# EAGLE design LTP-ISP ADAPTER (EAGLE 4.15)
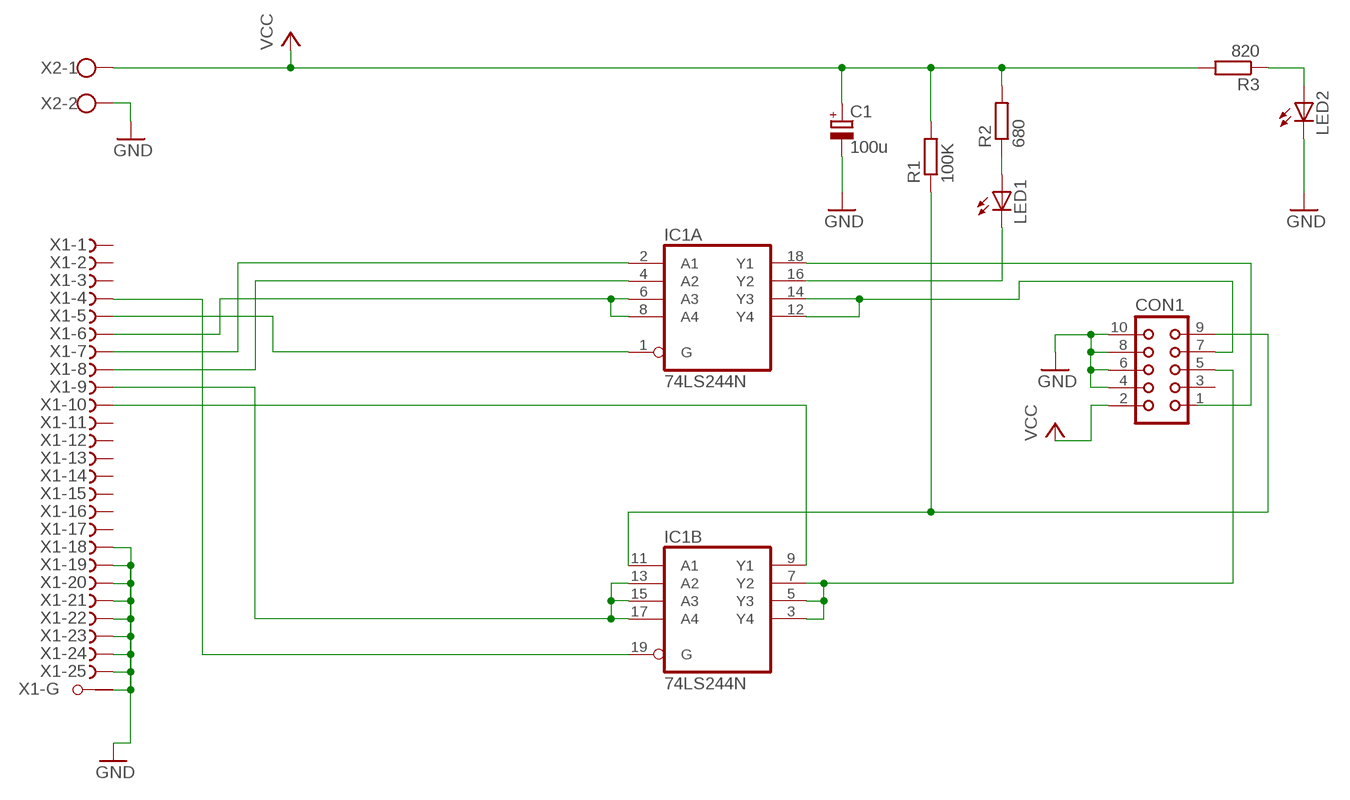
[diagram p0: schematic, sheet 1]

## Parts
C1  100u  CPOL-EUE2.5-7  [E2,5-7]
CON1  CON10  [CON10]
IC1  74LS244N  [DIL20]
LED1  LED3MM  [LED3MM]
LED2  LED3MM  [LED3MM]
R1  100K  R-EU_0207/7  [0207/7]
R2  680  R-EU_0207/7  [0207/7]
R3  820  R-EU_0207/7  [0207/7]
X1  F25HPS  [F25HP]
X2  W237-102  [W237-102]

## Nets
GND: C1.- CON1.4 CON1.6 CON1.8 CON1.10 LED2.K(C) X1.18(-18:F) X1.19(-19:F) X1.20(-20:F) X1.21(-21:F) X1.22(-22:F) X1.23(-23:F) X1.24(-24:F) X1.25(-25:F) X1.G1(-G:G1) X2.2
N$1: IC1.4(A:A2) X1.8(-8:F)
N$2: IC1.2(A:A1) X1.7(-7:F)
N$3: IC1.6(A:A3) IC1.8(A:A4) X1.6(-6:F)
N$4: IC1.1(A:G) X1.5(-5:F)
N$5: IC1.13(B:A2) IC1.15(B:A3) IC1.17(B:A4) X1.9(-9:F)
N$6: IC1.9(B:Y1) X1.10(-10:F)
N$7: IC1.19(B:G) X1.4(-4:F)
N$8: IC1.18(A:Y1)
N$9: CON1.7 IC1.12(A:Y4)
N$11: CON1.9 IC1.11(B:A1) R1.1
N$12: CON1.5 IC1.3(B:Y4) IC1.5(B:Y3) IC1.7(B:Y2)
N$14: IC1.16(A:Y2) LED1.K(C)
N$15: LED1.A R2.1
N$16: LED2.A R3.1
VCC: C1.+ CON1.2 R1.2 R2.2 R3.2 X2.1
Unconnected: CON1.1 CON1.3 IC1.14(A:Y3) X1.1(-1:F) X1.2(-2:F) X1.3(-3:F) X1.11(-11:F) X1.12(-12:F) X1.13(-13:F) X1.14(-14:F) X1.15(-15:F) X1.16(-16:F) X1.17(-17:F) X1.G2(-G:G2)

## Power pins joined to a net without a drawn wire
GND: IC1.10(P:GND)
VCC: IC1.20(P:VCC)

## Library data of the parts
C1 = rcl:CPOL-EU: POLARIZED CAPACITOR, European symbol
CON1 = con-harting:CON10: CONNECTOR
IC1 = 74xx-eu:74*244: Octal BUFFER and LINE DRIVER, 3-state
LED1 LED2 = led:LED: LED OSRAM: - CHIPLED LG R971, LG N971, LY N971, LG Q971, LY Q971, LO R971, LY R971 LH N974, LH R974 LS Q976, LO Q976, LY Q976 LO Q996 - Hyper CHIPLED LW Q18S LB Q993, LB Q99A, LB R99A - SideLED LS A670, LO A670, LY A670, LG A670, LP A670 LB A673, LV A673, LT A673, LW A673 LH A674 LY A675 LS A676, LA A676, LO A676, LY A676, LW A676 LS A679, LY A679, LG A679 - Hyper Micro SIDELED® LS Y876, LA Y876, LO Y876, LY Y876 LT Y87S - SmartLED LW L88C, LW L88S LB L89C, LB L89S, LG L890 LS L89K, LO L89K, LY L89K LS L896, LA L896, LO L896, LY L896 - TOPLED LS T670, LO T670, LY T670, LG T670, LP T670 LSG T670, LSP T670, LSY T670, LOP T670, LYG T670 LG T671, LOG T671, LSG T671 LB T673, LV T673, LT T673, LW T673 LH T674 LS T676, LA T676, LO T676, LY T676, LB T676, LH T676, LSB T676, LW T676 LB T67C, LV T67C, LT T67C, LS T67K, LO T67K, LY T67K, LW E67C LS E67B, LA E67B, LO E67B, LY E67B, LB E67C, LV E67C, LT E67C LW T67C LS T679, LY T679, LG T679 LS T770, LO T770, LY T770, LG T770, LP T770 LB T773, LV T773, LT T773, LW T773 LH T774 LS E675, LA E675, LY E675, LS T675 LS T776, LA T776, LO T776, LY T776, LB T776 LHGB T686 LT T68C, LB T68C - Hyper Mini TOPLED® LB M676 - Mini TOPLED Santana® LG M470 LS M47K, LO M47K, LY M47K Source: http://www.osram.convergy.de/
R1-R3 = rcl:R-EU_: RESISTOR, European symbol
X1 = con-subd:F25HPS: SUB-D
X2 = con-wago-500:W237-102: WAGO SCREW CLAMP

## Board
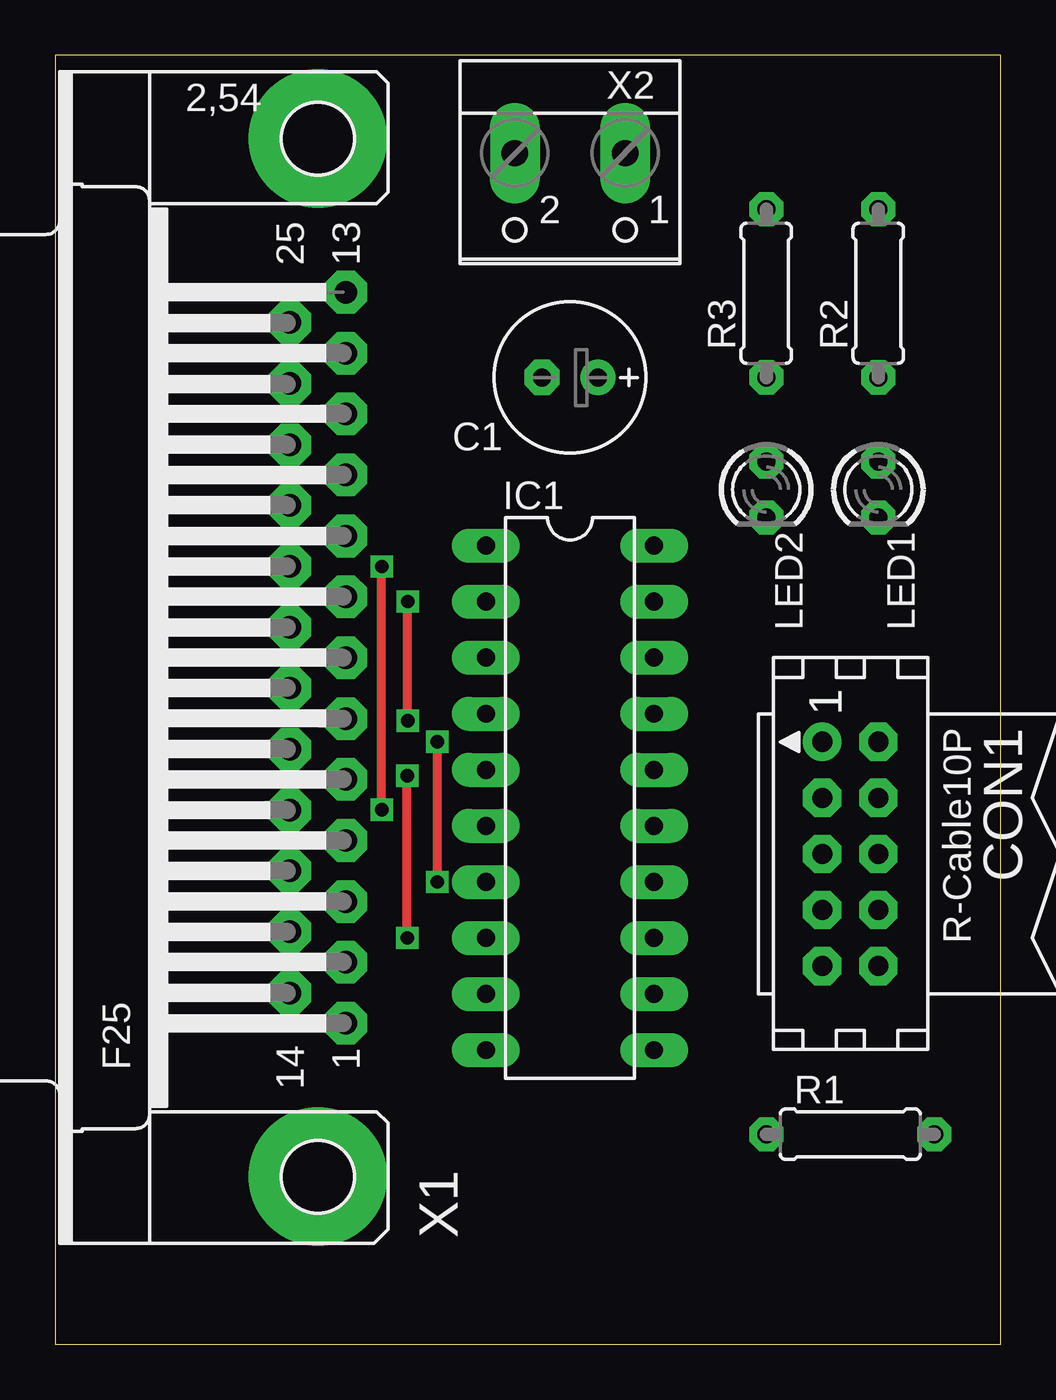
[diagram p1: board, top side]
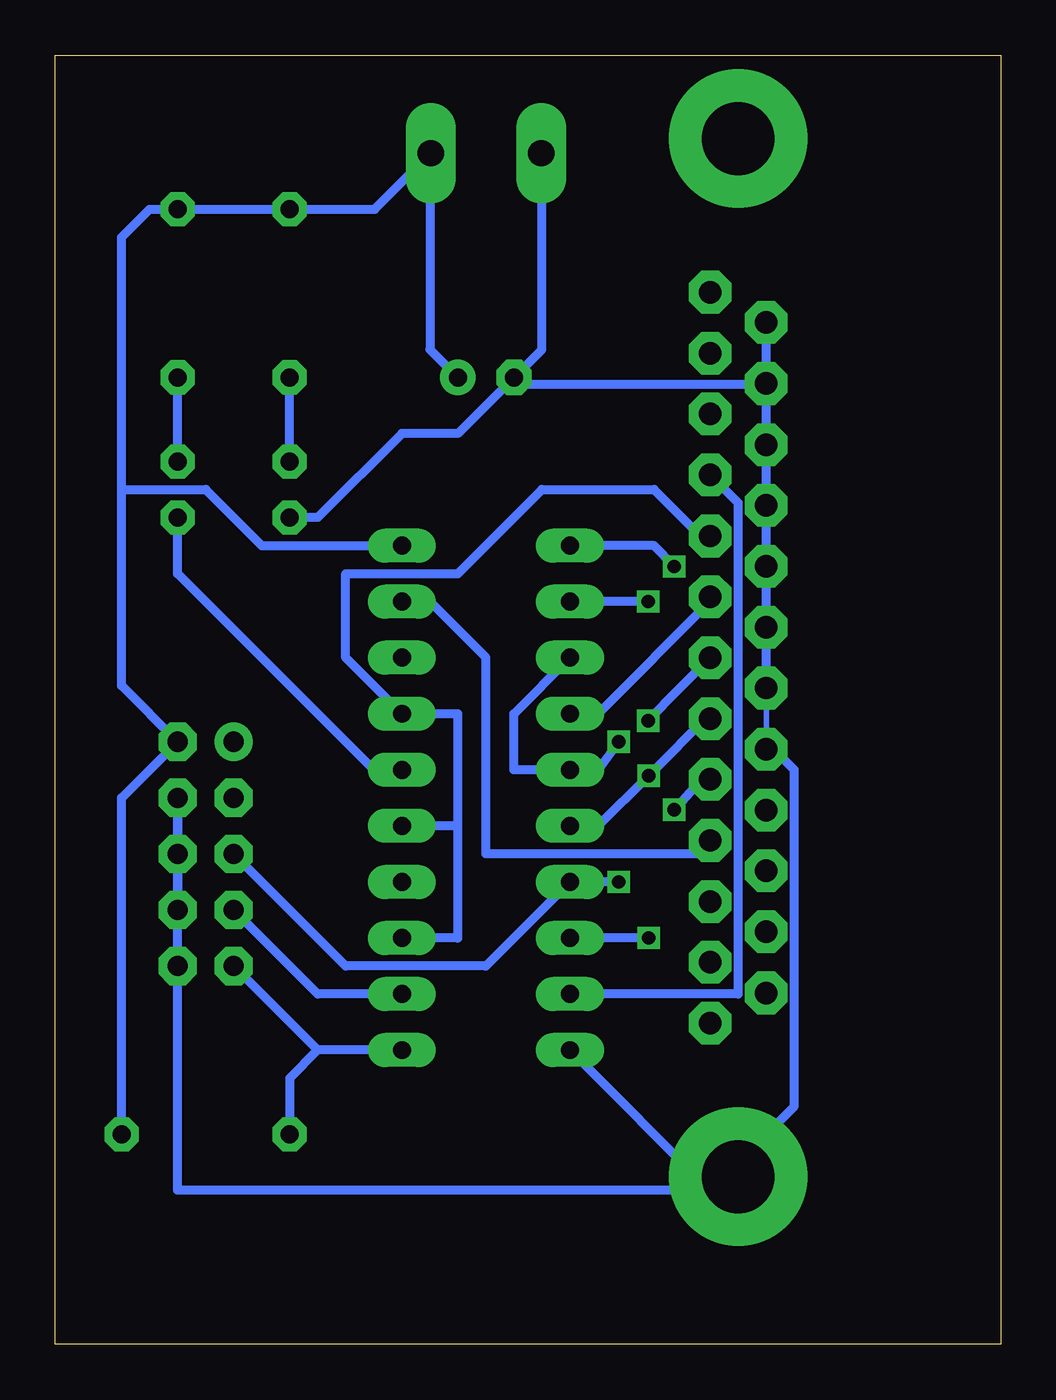
[diagram p2: board, bottom side, seen from below]

Size 42.85 x 58.41 mm. Coordinates in mm from the lower left corner, seen from the top.
Outline: 0,0 42.85,0 42.85,58.41 0,58.41 0,0
Copper layers (1*16): Top 0.035mm / dielectric 1.5mm / Bottom 0.035mm
Design rules "default": minimum track width 10mil, minimum drill 1mm, track to track 8mil, track to pad 8mil, pad to pad 8mil, via to via 8mil, smd to smd 8mil, copper to edge 40mil, drill to drill 8mil, minimum pad ring 10mil, minimum via ring 8mil, stop-mask expansion 4mil, vias tented up to drill 0mil, thermal gap 10mil

### Footprints (pad centres in the part's own frame; a part is rotated, then mirrored left to right if it is on the bottom)
E2,5-7 = drill 0.813 pad 1.6 round: + -1.27,0 | drill 0.813 pad 1.6 octagon: - 1.27,0
CON10 = drill 0.914 round: 1 -5.08,-1.27 | drill 0.914 octagon: 2 -5.08,1.27; 3 -2.54,-1.27; 4 -2.54,1.27; 5 0,-1.27; 6 0,1.27; 7 2.54,-1.27; 8 2.54,1.27; 9 5.08,-1.27; 10 5.08,1.27
DIL20 = drill 0.813 long: 1 -11.43,-3.81; 2 -8.89,-3.81; 3 -6.35,-3.81; 4 -3.81,-3.81; 5 -1.27,-3.81; 6 1.27,-3.81; 7 3.81,-3.81; 8 6.35,-3.81; 9 8.89,-3.81; 10 11.43,-3.81; 11 11.43,3.81; 12 8.89,3.81; 13 6.35,3.81; 14 3.81,3.81; 15 1.27,3.81; 16 -1.27,3.81; 17 -3.81,3.81; 18 -6.35,3.81; 19 -8.89,3.81; 20 -11.43,3.81
LED3MM = drill 0.813 octagon: A -1.27,0; K 1.27,0
0207/7 = drill 0.813 octagon: 1 -3.81,0; 2 3.81,0
F25HP = drill 1.016 octagon: 1 -16.561,-1.27; 2 -13.792,-1.27; 3 -11.049,-1.27; 4 -8.28,-1.27; 5 -5.512,-1.27; 6 -2.769,-1.27; 7 0,-1.27; 8 2.769,-1.27; 9 5.512,-1.27; 10 8.28,-1.27; 11 11.049,-1.27; 12 13.792,-1.27; 13 16.561,-1.27; 14 -15.189,1.27; 15 -12.421,1.27; 16 -9.652,1.27; 17 -6.909,1.27; 18 -4.14,1.27; 19 -1.372,1.27; 20 1.372,1.27; 21 4.14,1.27; 22 6.909,1.27; 23 9.652,1.27; 24 12.421,1.27; 25 15.189,1.27 | drill 3.302 pad 5.08 round: G1 -23.52,0; G2 23.52,0
W237-102 = drill 1.194 long: 1 -2.5,-1.27; 2 2.5,-1.27

### Placement (x,y rotation side)
C1  23.33,43.81 180 top
CON1  36.03,22.22 270 top
IC1  23.33,24.76 270 top
LED1  37.3,38.73 270 top
LED2  32.22,38.73 270 top
R1  36.03,9.52 0 top
R2  37.3,47.62 90 top
R3  32.22,47.62 90 top
X1  11.9,31.11 90 top
X2  23.33,52.7 180 top

### Tracks (layer width: path | path; a pad name or v marks a point on that pad's centre or on a via)
GND
  Bottom 0.254: 10.63,27.3 X1.19 | 37.3,6.98 CON1.10 | X1.G1 13.17,6.98
  Bottom 0.406: CON1.10 CON1.8 CON1.6 CON1.4 37.3,6.98 13.17,6.98 | LED2.K 30.95,37.46 27.14,41.27 24.6,41.27 C1.- | X2.2 20.79,53.97 20.79,45.08 C1.- | X1.23 10.63,41.27 | X1.23 X1.22 X1.21 X1.20 X1.19 | X1.23 X1.24 10.63,43.81 | 10.63,46.35 X1.25 10.63,43.81 | 13.17,6.98 IC1.10 | 13.17,6.98 9.36,10.79 9.36,26.03 10.63,27.3 X1.18 | 10.63,43.81 10.61,43.81 10.61,43.47 21.79,43.47 22.08,43.76 22.06,43.78 C1.-
N$1
  Bottom 0.406: X1.8 13.17,33.65 18.25,28.57 IC1.4
N$2  (via drill 0.6)
  Top 0.406: v15.98,28.26 v15.98,33.65
  Bottom 0.406: X1.7 v15.98,28.26 | v15.98,33.65 IC1.2
N$3  (via drill 0.6)
  Top 0.406: v15.96,18.41 v15.96,25.76
  Bottom 0.406: X1.6 13.17,28.57 v15.96,25.76 18.25,23.49 IC1.6 | v15.96,18.41 IC1.8
N$4  (via drill 0.6)
  Top 0.406: v14.8,24.22 v14.8,35.24
  Bottom 0.406: IC1.1 15.71,36.19 v14.8,35.24 | X1.5 13.17,26.03 v14.8,24.22
N$5
  Bottom 0.406: IC1.13 24.6,18.41 24.6,23.49 | 24.6,23.49 IC1.15 | 24.6,23.49 24.6,28.57 IC1.17 29.68,31.11 29.68,34.92 24.6,34.92 20.79,38.73 15.71,38.73 13.17,36.19 X1.9
N$6
  Bottom 0.406: X1.10 11.9,38.12 11.9,15.87 IC1.9
N$7
  Bottom 0.406: X1.4 13.78,22.22 23.33,22.22 23.33,31.11 25.87,33.65 IC1.19
N$9
  Bottom 0.406: CON1.7 30.95,15.87 IC1.12
N$11
  Bottom 0.406: 30.95,13.33 CON1.9 | IC1.11 30.95,13.33 | 30.95,13.33 32.22,12.06 R1.1
N$12  (via drill 0.6)
  Top 0.406: v17.32,20.95 v17.32,27.3
  Bottom 0.406: CON1.5 29.68,17.14 23.33,17.14 IC1.7 v17.32,20.95 | IC1.3 22.06,28.57 22.06,26.03 IC1.5 18.25,26.03 v17.32,27.3
N$14
  Bottom 0.406: LED1.K 37.3,34.92 28.41,26.03 IC1.16
N$15
  Bottom 0.406: LED1.A R2.1
N$16
  Bottom 0.406: LED2.A R3.1
VCC
  Bottom 0.406: C1.+ 25.87,45.08 25.87,53.97 | 25.87,53.97 X2.1 28.37,51.43 R3.2 R2.2 38.57,51.43 39.84,50.16 39.84,38.73 | 25.87,53.97 25.87,55.24 | R1.2 39.84,24.76 CON1.2 39.84,29.84 39.84,38.73 | IC1.20 33.49,36.19 36.03,38.73 39.84,38.73